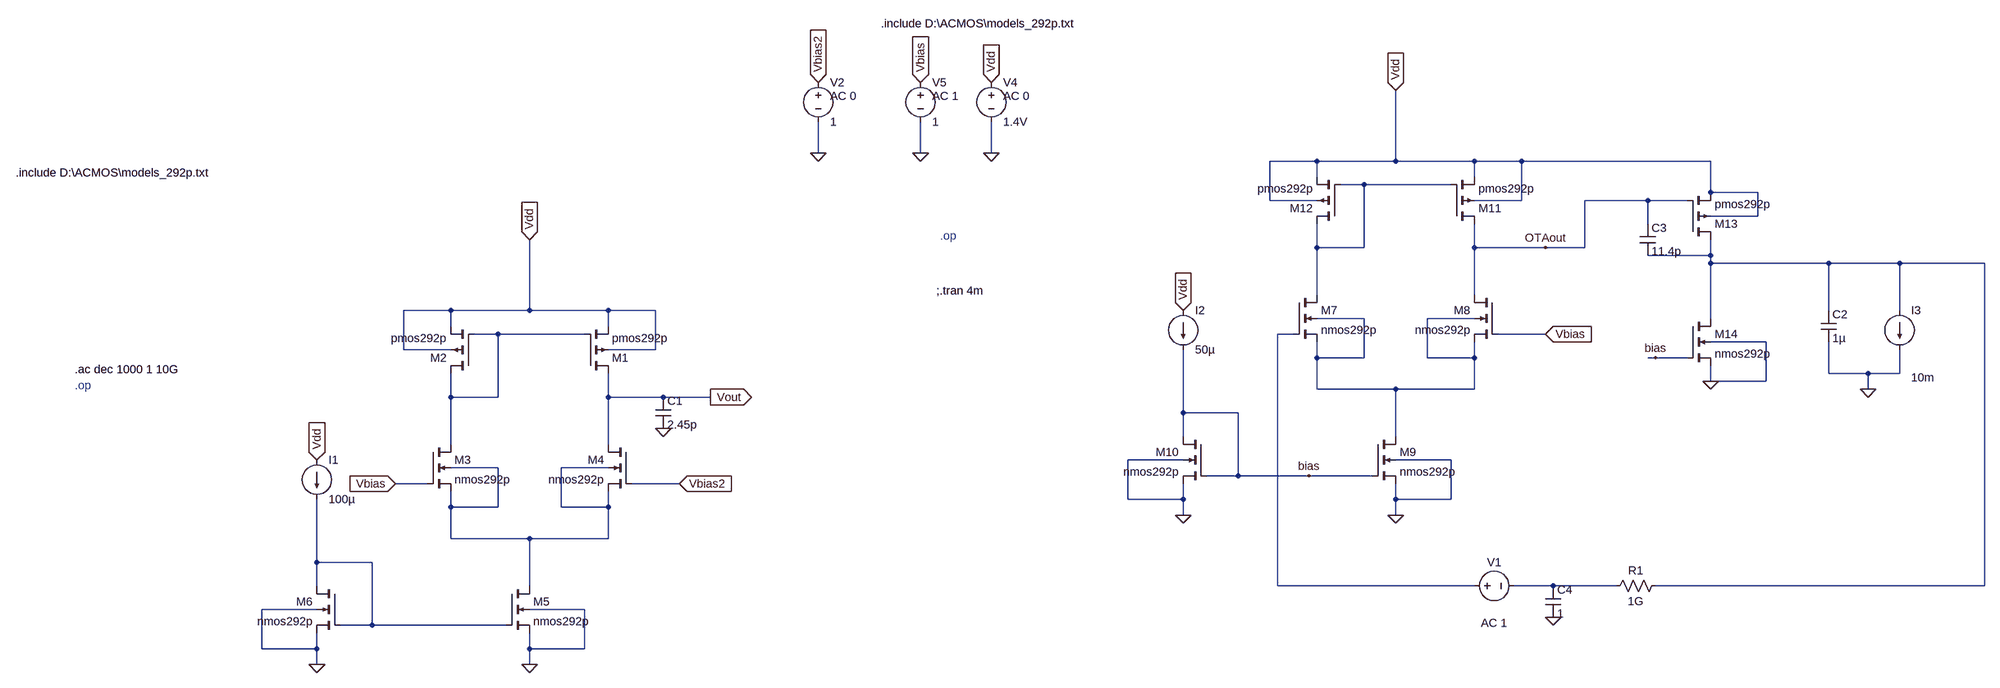
[diagram p0: schematic 5T_OTA_nmos.asc]
5T_OTA_nmos.asc, the LTspice schematic file:
Version 4.1
SHEET 1 4012 756
WIRE 1136 -304 1136 -368
WIRE 1344 -304 1344 -368
WIRE 1488 -304 1488 -368
WIRE 2288 -288 2192 -288
WIRE 2448 -288 2448 -432
WIRE 2448 -288 2288 -288
WIRE 2608 -288 2448 -288
WIRE 2704 -288 2608 -288
WIRE 3088 -288 2704 -288
WIRE 2288 -256 2288 -288
WIRE 2608 -256 2608 -288
WIRE 2384 -240 2336 -240
WIRE 2560 -240 2384 -240
WIRE 3088 -224 3088 -288
WIRE 3184 -224 3088 -224
WIRE 2192 -208 2192 -288
WIRE 2288 -208 2192 -208
WIRE 2704 -208 2704 -288
WIRE 2704 -208 2608 -208
WIRE 2960 -208 2832 -208
WIRE 3040 -208 2960 -208
WIRE 3184 -176 3184 -224
WIRE 3184 -176 3088 -176
WIRE 2960 -160 2960 -208
WIRE 2288 -112 2288 -160
WIRE 2384 -112 2384 -240
WIRE 2384 -112 2288 -112
WIRE 2608 -112 2608 -160
WIRE 2752 -112 2608 -112
WIRE 2832 -112 2832 -208
WIRE 2832 -112 2752 -112
WIRE 3088 -96 3088 -128
WIRE 3088 -96 2960 -96
WIRE 3088 -80 3088 -96
WIRE 3376 -80 3088 -80
WIRE 3520 -80 3376 -80
WIRE 3696 -80 3520 -80
WIRE 2288 -16 2288 -112
WIRE 2608 -16 2608 -112
WIRE 176 16 80 16
WIRE 336 16 336 -128
WIRE 336 16 176 16
WIRE 496 16 336 16
WIRE 592 16 496 16
WIRE 3376 16 3376 -80
WIRE 3520 16 3520 -80
WIRE 2384 32 2288 32
WIRE 2608 32 2512 32
WIRE 3088 32 3088 -80
WIRE 176 48 176 16
WIRE 496 48 496 16
WIRE 272 64 224 64
WIRE 448 64 272 64
WIRE 2240 64 2208 64
WIRE 2752 64 2656 64
WIRE 3200 80 3088 80
WIRE 80 96 80 16
WIRE 176 96 80 96
WIRE 592 96 592 16
WIRE 592 96 496 96
WIRE 2288 112 2288 80
WIRE 2384 112 2384 32
WIRE 2384 112 2288 112
WIRE 2512 112 2512 32
WIRE 2608 112 2608 80
WIRE 2608 112 2512 112
WIRE 2976 112 2960 112
WIRE 3040 112 2976 112
WIRE 3376 144 3376 80
WIRE 3456 144 3376 144
WIRE 3520 144 3520 96
WIRE 3520 144 3456 144
WIRE 3088 160 3088 128
WIRE 3200 160 3200 80
WIRE 3200 160 3088 160
WIRE 2288 176 2288 112
WIRE 2448 176 2288 176
WIRE 2608 176 2608 112
WIRE 2608 176 2448 176
WIRE 3456 176 3456 144
WIRE 176 192 176 144
WIRE 272 192 272 64
WIRE 272 192 176 192
WIRE 496 192 496 144
WIRE 608 192 496 192
WIRE 704 192 608 192
WIRE 2016 224 2016 96
WIRE 2128 224 2016 224
WIRE 2016 272 2016 224
WIRE 2448 272 2448 176
WIRE 176 288 176 192
WIRE 496 288 496 192
WIRE 2016 320 1904 320
WIRE 2560 320 2448 320
WIRE 272 336 176 336
WIRE 496 336 400 336
WIRE 2128 352 2128 224
WIRE 2128 352 2064 352
WIRE 2272 352 2128 352
WIRE 2400 352 2272 352
WIRE 128 368 64 368
WIRE 640 368 544 368
WIRE 1904 400 1904 320
WIRE 2016 400 2016 368
WIRE 2016 400 1904 400
WIRE 2448 400 2448 368
WIRE 2560 400 2560 320
WIRE 2560 400 2448 400
WIRE 176 416 176 384
WIRE 272 416 272 336
WIRE 272 416 176 416
WIRE 400 416 400 336
WIRE 496 416 496 384
WIRE 496 416 400 416
WIRE 2016 432 2016 400
WIRE 2448 432 2448 400
WIRE 176 480 176 416
WIRE 336 480 176 480
WIRE 496 480 496 416
WIRE 496 480 336 480
WIRE -96 528 -96 400
WIRE 16 528 -96 528
WIRE -96 576 -96 528
WIRE 336 576 336 480
WIRE 2208 576 2208 64
WIRE 2608 576 2208 576
WIRE 2768 576 2688 576
WIRE 2896 576 2768 576
WIRE 3696 576 3696 -80
WIRE 3696 576 2976 576
WIRE -96 624 -208 624
WIRE 448 624 336 624
WIRE 16 656 16 528
WIRE 16 656 -48 656
WIRE 288 656 16 656
WIRE -208 704 -208 624
WIRE -96 704 -96 672
WIRE -96 704 -208 704
WIRE 336 704 336 672
WIRE 448 704 448 624
WIRE 448 704 336 704
WIRE -96 736 -96 704
WIRE 336 736 336 704
FLAG 336 736 0
FLAG -96 736 0
FLAG 336 -128 Vdd
IOPIN 336 -128 In
FLAG -96 320 Vdd
IOPIN -96 320 In
FLAG 64 368 Vbias
IOPIN 64 368 In
FLAG 640 368 Vbias2
IOPIN 640 368 In
FLAG 704 192 Vout
IOPIN 704 192 Out
FLAG 608 256 0
FLAG 2448 432 0
FLAG 2016 432 0
FLAG 2448 -432 Vdd
IOPIN 2448 -432 In
FLAG 1488 -304 0
FLAG 1488 -448 Vdd
IOPIN 1488 -448 In
FLAG 2016 16 Vdd
IOPIN 2016 16 In
FLAG 1344 -304 0
FLAG 1344 -448 Vbias
IOPIN 1344 -448 In
FLAG 3088 160 0
FLAG 3456 176 0
FLAG 2272 352 bias
FLAG 2976 112 bias
FLAG 2752 64 Vbias
IOPIN 2752 64 In
FLAG 2752 -112 OTAout
FLAG 2768 640 0
FLAG 1136 -304 0
FLAG 1136 -448 Vbias2
IOPIN 1136 -448 In
SYMBOL nmos4 128 288 R0
SYMATTR InstName M3
SYMATTR Value nmos292p
SYMATTR Value2 l=1080n w=12.5u
SYMBOL nmos4 544 288 M0
SYMATTR InstName M4
SYMATTR Value nmos292p
SYMATTR Value2 l=1080n w=12.5u
SYMBOL nmos4 288 576 R0
SYMATTR InstName M5
SYMATTR Value nmos292p
SYMATTR Value2 l=1260n w=50u
SYMBOL nmos4 -48 576 M0
SYMATTR InstName M6
SYMATTR Value nmos292p
SYMATTR Value2 l=1260n w=50u
SYMBOL current -96 320 R0
WINDOW 123 0 0 Left 0
WINDOW 39 0 0 Left 0
SYMATTR InstName I1
SYMATTR Value 100µ
SYMBOL pmos4 448 144 M180
SYMATTR InstName M1
SYMATTR Value pmos292p
SYMATTR Value2 l=1260n w=62.5u
SYMBOL pmos4 224 144 R180
SYMATTR InstName M2
SYMATTR Value pmos292p
SYMATTR Value2 l=1260n w=62.5u
SYMBOL cap 592 192 R0
SYMATTR InstName C1
SYMATTR Value 2.45p
SYMBOL nmos4 2240 -16 R0
SYMATTR InstName M7
SYMATTR Value nmos292p
SYMATTR Value2 l=0.63u w=66.67u
SYMBOL nmos4 2656 -16 M0
SYMATTR InstName M8
SYMATTR Value nmos292p
SYMATTR Value2 l=0.63u w=66.67u
SYMBOL nmos4 2400 272 R0
SYMATTR InstName M9
SYMATTR Value nmos292p
SYMATTR Value2 l=1.26u w=40u
SYMBOL nmos4 2064 272 M0
SYMATTR InstName M10
SYMATTR Value nmos292p
SYMATTR Value2 l=1.26u w=40u
SYMBOL current 2016 16 R0
WINDOW 123 0 0 Left 0
WINDOW 39 0 0 Left 0
SYMATTR InstName I2
SYMATTR Value 50µ
SYMBOL pmos4 2560 -160 M180
SYMATTR InstName M11
SYMATTR Value pmos292p
SYMATTR Value2 l=0.54u w=333.34u
SYMBOL pmos4 2336 -160 R180
SYMATTR InstName M12
SYMATTR Value pmos292p
SYMATTR Value2 l=0.54u w=333.34u
SYMBOL voltage 1488 -464 R0
WINDOW 123 24 44 Left 2
WINDOW 39 0 0 Left 0
SYMATTR Value2 AC 0
SYMATTR InstName V4
SYMATTR Value 1.4V
SYMBOL voltage 1344 -464 R0
WINDOW 123 24 44 Left 2
WINDOW 39 0 0 Left 0
SYMATTR Value2 AC 1
SYMATTR InstName V5
SYMATTR Value 1
SYMBOL pmos4 3040 -128 M180
SYMATTR InstName M13
SYMATTR Value pmos292p
SYMATTR Value2 l=180n w=1.1m
SYMBOL nmos4 3040 32 R0
SYMATTR InstName M14
SYMATTR Value nmos292p
SYMATTR Value2 l=1.26u w=40u
SYMBOL cap 3360 16 R0
SYMATTR InstName C2
SYMATTR Value 1µ
SYMBOL current 3520 16 R0
WINDOW 3 24 136 Left 2
WINDOW 123 0 0 Left 0
WINDOW 39 24 108 Left 2
SYMATTR Value 10m
SYMATTR InstName I3
SYMBOL cap 2944 -160 R0
SYMATTR InstName C3
SYMATTR Value 11.4p
SYMBOL voltage 2592 576 R270
WINDOW 0 32 56 VTop 2
WINDOW 3 -32 56 VBottom 2
WINDOW 123 -60 56 VBottom 2
WINDOW 39 0 0 Left 0
SYMATTR InstName V1
SYMATTR Value ""
SYMATTR Value2 AC 1
SYMBOL cap 2752 576 R0
SYMATTR InstName C4
SYMATTR Value 1
SYMBOL res 2992 560 R90
WINDOW 0 0 56 VBottom 2
WINDOW 3 32 56 VTop 2
SYMATTR InstName R1
SYMATTR Value 1G
SYMBOL voltage 1136 -464 R0
WINDOW 123 24 44 Left 2
WINDOW 39 0 0 Left 0
SYMATTR Value2 AC 0
SYMATTR InstName V2
SYMATTR Value 1
TEXT -848 -264 Left 2 !.include D:\\ACMOS\\models_292p.txt
TEXT -728 136 Left 2 !.ac dec 1000 1 10G
TEXT -728 168 Left 2 ;.op
TEXT 1264 -568 Left 2 !.include D:\\ACMOS\\models_292p.txt
TEXT 1384 -136 Left 2 ;.op
TEXT 1376 -24 Left 2 !;.tran 4m

The netlist it stands for:
* 5T_OTA_nmos.asc
M3 N004 Vbias N006 N006 nmos292p l=1080n w=12.5u
M4 Vout Vbias2 N006 N006 nmos292p l=1080n w=12.5u
M5 N006 N007 0 0 nmos292p l=1260n w=50u
M6 N007 N007 0 0 nmos292p l=1260n w=50u
I1 Vdd N007 100µ
M1 Vout N004 Vdd Vdd pmos292p l=1260n w=62.5u
M2 N004 N004 Vdd Vdd pmos292p l=1260n w=62.5u
C1 Vout 0 2.45p
M7 N001 N005 N003 N003 nmos292p l=0.63u w=66.67u
M8 OTAout Vbias N003 N003 nmos292p l=0.63u w=66.67u
M9 N003 bias 0 0 nmos292p l=1.26u w=40u
M10 bias bias 0 0 nmos292p l=1.26u w=40u
I2 Vdd bias 50µ
M11 OTAout N001 Vdd Vdd pmos292p l=0.54u w=333.34u
M12 N001 N001 Vdd Vdd pmos292p l=0.54u w=333.34u
V4 Vdd 0 1.4V AC 0
V5 Vbias 0 1 AC 1
M13 N002 OTAout Vdd Vdd pmos292p l=180n w=1.1m
M14 N002 bias 0 0 nmos292p l=1.26u w=40u
C2 N002 0 1µ
I3 N002 0 10m
C3 OTAout N002 11.4p
V1 N005 N008 AC 1
C4 N008 0 1
R1 N002 N008 1G
V2 Vbias2 0 1 AC 0
.model NMOS NMOS
.model PMOS PMOS
.lib standard.mos
.include D:\ACMOS\models_292p.txt
.ac dec 1000 1 10G
* .op
.include D:\ACMOS\models_292p.txt
* .op
;.tran 4m
.backanno
.end